# EAGLE design MLX90393_Magnetometer_Breakout (EAGLE 7.6.0)
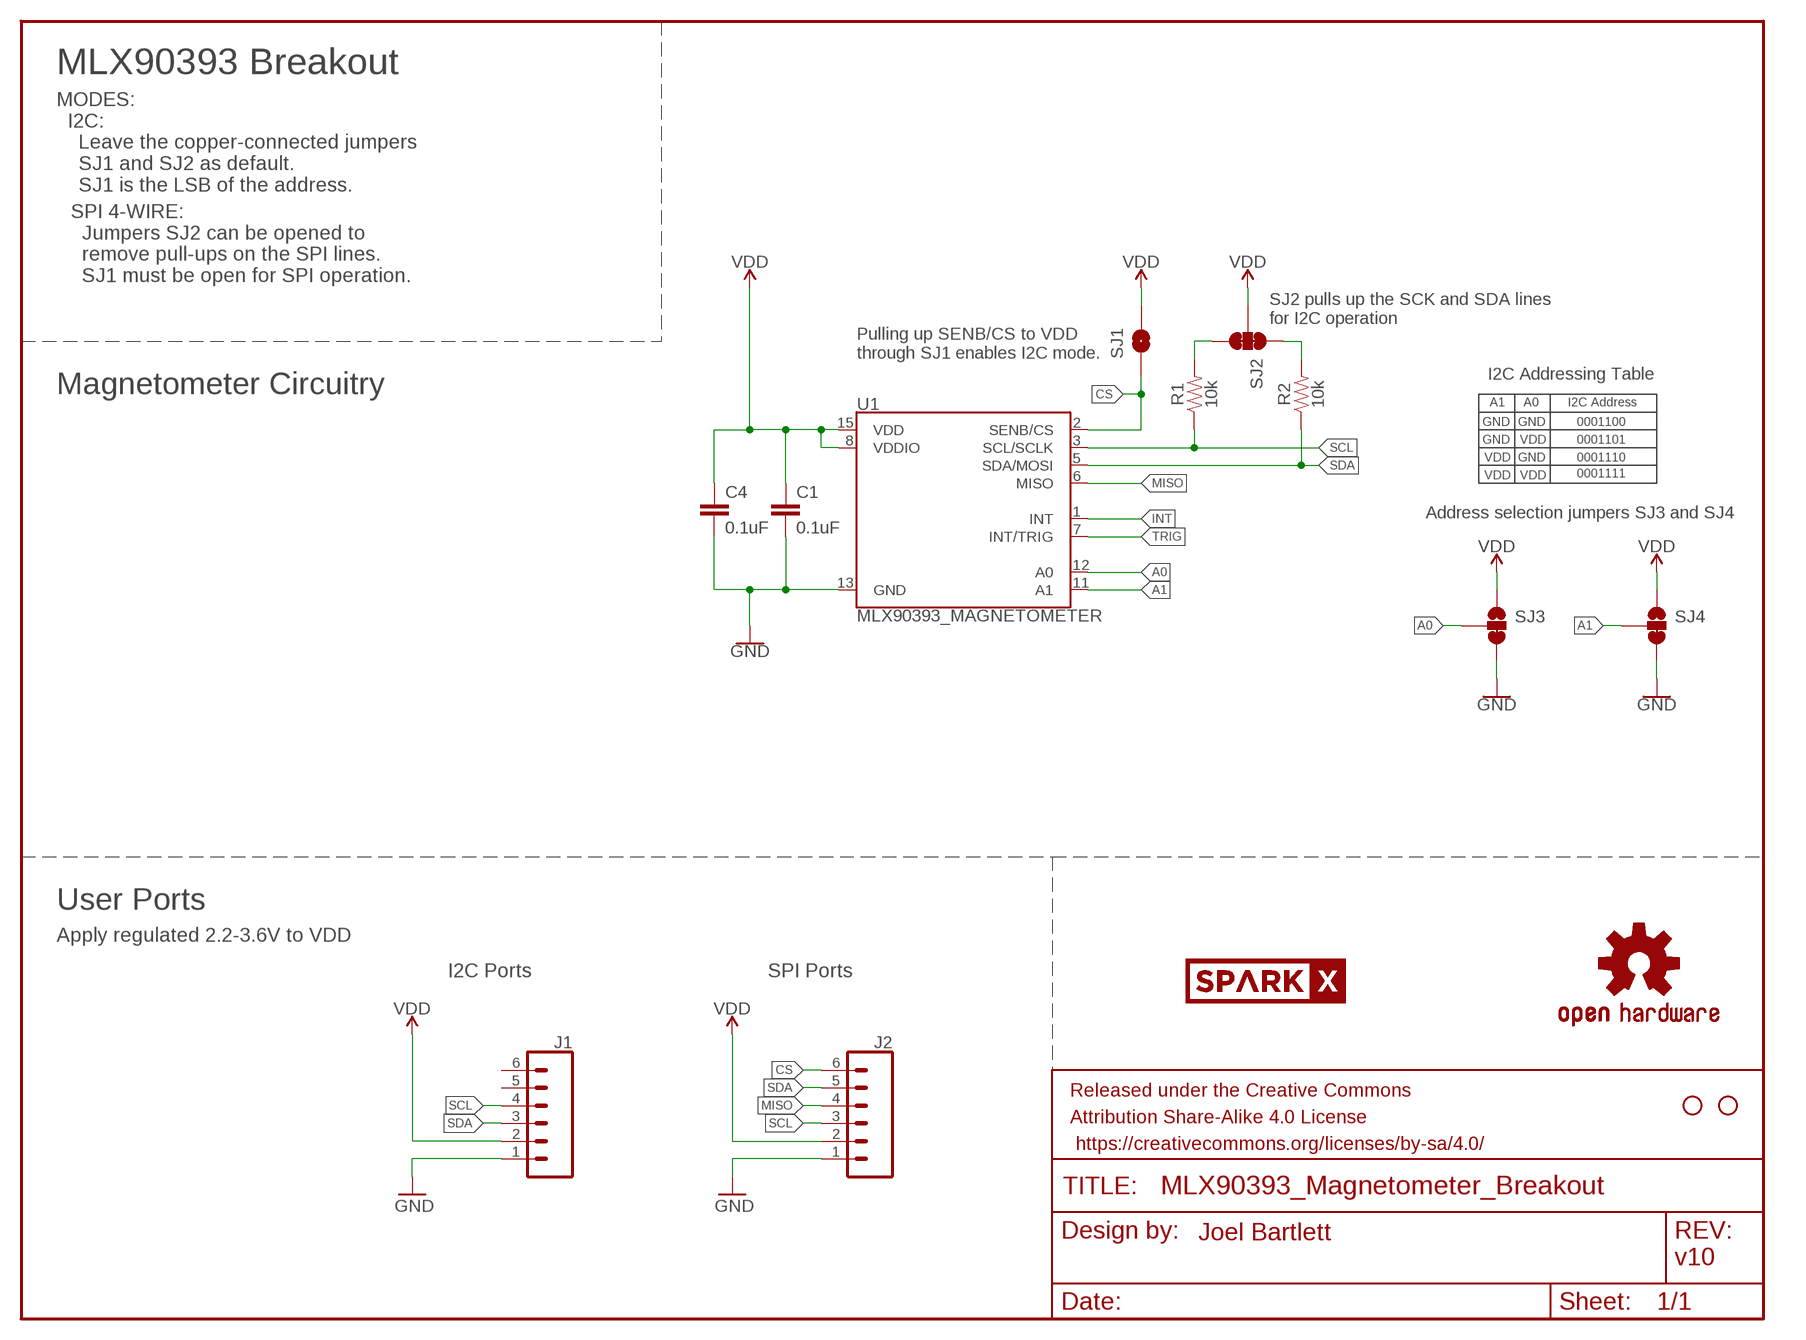
[diagram p0: schematic, sheet 1]

## Parts
C1  0.1uF  0.1UF-0603-25V-(+80/-20%)  [0603]
C4  0.1uF  0.1UF-0603-25V-(+80/-20%)  [0603]
FRAME2  FRAME-LETTER  [CREATIVE_COMMONS]
J1  CONN_06NO_SILK_FEMALE_PTH  [1X06_NO_SILK]
J2  CONN_06NO_SILK_FEMALE_PTH  [1X06_NO_SILK]
JP3  STAND-OFF  [STAND-OFF]
JP4  STAND-OFF  [STAND-OFF]
R1  10k  10KOHM-0603-1/10W-1%  [0603]
R2  10k  10KOHM-0603-1/10W-1%  [0603]
SJ1  SOLDERJUMPERTRACE  [SJ_2S-TRACE]
SJ2  JUMPER-PAD-3-NC_BY_TRACE  [PAD-JUMPER-3-3OF3_NC_BY_TRACE_YES_SILK_FULL_BOX]
SJ3  JUMPER-SMT_3_1-NC_TRACE_SILK  [SMT-JUMPER_3_1-NC_TRACE_SILK]
SJ4  JUMPER-SMT_3_1-NC_TRACE_SILK  [SMT-JUMPER_3_1-NC_TRACE_SILK]
U1  MLX90393_MAGNETOMETER  [QFN-16]
U$1  OSHW-LOGOS  [OSHW-LOGO-S]
U$2  SPARKX-LOGO2  [SPARKX-TINY]

## Nets
A0: SJ3.2 U1.12(A0)
A1: SJ4.2 U1.11(A1)
CS: J2.6 SJ1.1 U1.2(SENB/CS)
GND: C1.2 C4.2 J1.1 J2.1 SJ3.3 SJ4.3 U1.13(GND)
INT: U1.1(INT)
MISO: J2.4 U1.6(MISO)
N$4: R2.2 SJ2.1
N$5: R1.2 SJ2.3
SCL: J1.4 J2.3 R1.1 U1.3(SCL/SCLK)
SDA: J1.3 J2.5 R2.1 U1.5(SDA/MOSI)
TRIG: U1.7(INT/TRIG)
VDD: C1.1 C4.1 J1.2 J2.2 SJ1.2 SJ2.2 SJ3.1 SJ4.1 U1.8(VDDIO) U1.15(VDD)
Unconnected: J1.5 J1.6

## Notes on the sheet
- MLX90393 Breakout
- MODES:
    I2C:
      Leave the copper-connected jumpers
      SJ1 and SJ2 as default.
      SJ1 is the LSB of the address.
- SPI 4-WIRE:
    Jumpers SJ2 can be opened to 
    remove pull-ups on the SPI lines.
    SJ1 must be open for SPI operation.
- SJ2 pulls up the SCK and SDA lines
  for I2C operation
- Pulling up SENB/CS to VDD 
  through SJ1 enables I2C mode.
- I2C Addressing Table
- Magnetometer Circuitry
- A1 | A0 | I2C Address
- GND | GND | 0001100
- GND | VDD | 0001101
- VDD | GND | 0001110
- VDD | VDD | 0001111
- Address selection jumpers SJ3 and SJ4
- User Ports
- Apply regulated 2.2-3.6V to VDD
- I2C Ports | SPI Ports
- Joel Bartlett
- v10

## Library data of the parts
C1 C4 = SparkFun-Capacitors:0.1UF: 0.1µF ceramic capacitors A capacitor is a passive two-terminal electrical component used to store electrical energy temporarily in an electric field.; PROD_ID: CAP-00810
FRAME2 = SparkFun-Aesthetics:FRAME-LETTER: Schematic Frame Standard 8.5x11 US Letter frame
J1 J2 = SparkFun-Connectors:CONN_06: Header 6 Standard 6-pin 0.1" header. Use with straight break away headers (SKU : PRT-00116), right angle break away headers (PRT-00553), swiss pins (PRT-00743), machine pins (PRT-00117), and female headers (PRT-00115). Molex polarized connector foot print use with SKU : PRT-08094 with associated crimp pins and housings. NOTES ON THE VARIANTS LOCK and LOCK_LONGPADS... This footprint was designed to help hold the alignment of a through-hole component (i.e. 6-pin header) while soldering it into place. You may notice that each hole has been shifted either up or down by 0.005 of an inch from it's more standard position (which is a perfectly straight line). This slight alteration caused the pins (the squares in the middle) to touch the edges of the holes. Because they are alternating, it causes a "brace" to hold the component in place. 0.005 has proven to be the perfect amount of "off-center" position when using our standard breakaway headers. Although looks a little odd when you look at the bare footprint, once you have a header in there, the alteration is very hard to notice. Also,if you push a header all the way into place, it is covered up entirely on the bottom side. This idea of altering the position of holes to aid alignment will be further integrated into the Sparkfun Library for other footprints. It can help hold any component with 3 or more connection pins.; PROD_ID: CONN-08437
JP3 JP4 = SparkFun:STAND-OFF: Stand Off This is the mechanical footprint for a #4 phillips button head screw. Use the keepout ring to avoid running the screw head into surrounding components. SKU : PRT-00447
R1 R2 = SparkFun-Resistors:10KOHM: 10kΩ resistor A resistor is a passive two-terminal electrical component that implements electrical resistance as a circuit element. Resistors act to reduce current flow, and, at the same time, act to lower voltage levels within circuits.; PROD_ID: RES-00824
SJ1 = SparkFun:SOLDERJUMPER: Solder Jumper Standard SMD solder jumper. Used to automate production. Two varients : Normally Open and Normally Closed are the same, but have different paste layers. NC will have a large amount of paste and should jumper during reflow.
SJ2 = TestAperatures:JUMPER-PAD-3-NC_BY_TRACE
SJ3 SJ4 = SparkFun-Jumpers:JUMPER-SMT_3_1-NC_TRACE: Normally closed trace jumper (1 of 2 connections) This jumper has a trace between two pads so it's normally closed (NC). The other connection is normally open (NO). Use a razor knife to open the connection. For best results follow the IPC guidelines for cutting traces: Cutout at least 0.063 mm (0.005 in). Remove all loose material to clean up the cut area. Seal the cut with an approved epoxy. Reapply solder to reclose the connection, or to close the NO connection.
U1 = SparkX:MLX90393_MAGNETOMETER
U$1 = SparkFun:OSHW-LOGO: Open Source Hardware Logo This logo indicates the piece of hardware it is found on incorporates a OSHW license and/or adheres to the definition of open source hardware found here: http://freedomdefined.org/OSHW
U$2 = SparkX:SPARKX-LOGO

## Board
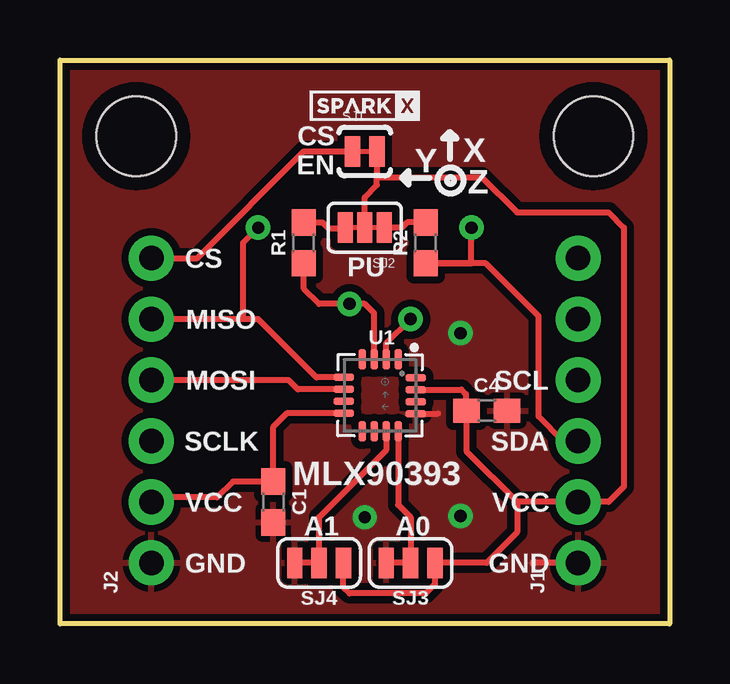
[diagram p1: board, top side]
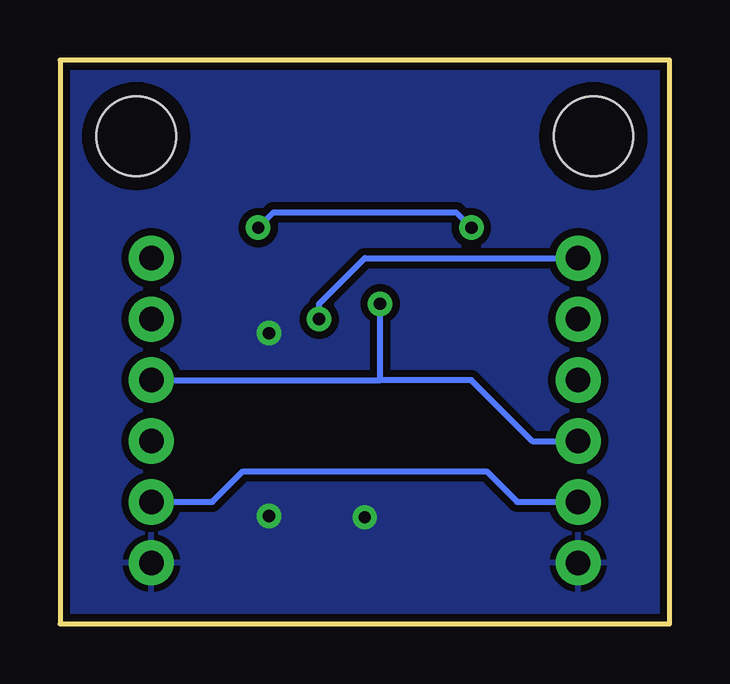
[diagram p2: board, bottom side, seen from below]

Size 25.4 x 23.5 mm. Coordinates in mm from the lower left corner, seen from the top.
Outline: 25.4,0 0,0 0,23.5 25.4,23.5 25.4,0
Copper layers (1*16): Top 0.035mm / dielectric 1.5mm / Bottom 0.035mm
Design rules "SparkFun-2-layer-STANDARD": minimum track width 10mil, minimum drill 20mil, track to track 10mil, track to pad 8mil, pad to pad 8mil, via to via 10mil, smd to smd 8mil, copper to edge 8mil, drill to drill 8mil, minimum pad ring 10mil, minimum via ring 10mil, stop-mask expansion 4mil, vias tented up to drill 25mil, thermal gap 10mil

### Footprints (pad centres in the part's own frame; a part is rotated, then mirrored left to right if it is on the bottom)
0603 = smd 1.1 x 1: 1 -0.85,0; 2 0.85,0
1X06_NO_SILK = drill 1.016 pad 1.88: 1 0,0; 2 2.54,0; 3 5.08,0; 4 7.62,0; 5 10.16,0; 6 12.7,0
STAND-OFF = hole 3.302: 0,0
SJ_2S-TRACE = smd 0.635 x 1.27: 1 -0.508,0; 2 0.508,0
PAD-JUMPER-3-3OF3_NC_BY_TRACE_YES_SILK_FULL_BOX = smd 0.635 x 1.27: 1 -0.813,0; 2 0,0; 3 0.813,0
SMT-JUMPER_3_1-NC_TRACE_SILK = smd 0.635 x 1.27: 1 -1.016,0; 2 0,0; 3 1.016,0
QFN-16 = smd 0.3 x 0.85: 1 0.754,1.498; 2 0.254,1.498; 3 -0.246,1.498; 4 -0.746,1.498; 9 -0.746,-1.506; 10 -0.246,-1.506; 11 0.254,-1.506; 12 0.754,-1.506 | smd 0.85 x 0.3: 5 -1.508,0.746; 6 -1.508,0.246; 7 -1.508,-0.254; 8 -1.508,-0.754; 13 1.496,-0.764; 14 1.496,-0.264; 15 1.496,0.236; 16 1.496,0.736

### Placement (x,y rotation side)
C1  8.89,5.08 270 top
C4  17.78,8.89 0 top
FRAME2  -18.41,-8.89 0 top  (outside the outline)
J1  21.59,2.54 90 top
J2  3.81,2.54 90 top
JP3  3.17,20.32 0 top
JP4  22.22,20.32 0 top
R1  10.16,15.88 90 top
R2  15.24,15.88 90 top
SJ1  12.7,19.68 0 top
SJ2  12.7,16.51 180 top
SJ3  14.61,2.54 180 top
SJ4  10.8,2.54 180 top
U1  13.34,9.53 0 top
U$1  -10.8,0.64 0 bottom  (outside the outline)
U$2  12.7,21.59 0 top

### Tracks (layer width: path | path; a pad name or v marks a point on that pad's centre or on a via)
A0
  Top 0.254: U1.12 14.09,4.96 14.61,4.45 SJ3.2
A1
  Top 0.254: SJ4.2 10.8,4.45 13.59,7.24 U1.11
CS  (via drill 0.51)
  Top 0.254: J2.6 5.71,15.24 10.16,19.68 SJ1.1 | U1.2 13.59,11.68 v14.61,12.7
  Bottom 0.254: v14.61,12.7 14.61,13.33 12.7,15.24 J2.6
GND  (via drill 0.51)
  Top 0.254: J1.1 19.68,2.54 | 14.86,8.76 15.75,8.76
  other vias: 16.69,4.5 12.7,4.45 16.69,12.12
  pour Top (isolate 0.305): 0,23.5 0,0 25.4,0 25.4,23.5
  pour Bottom (isolate 0.305): 0,23.5 0,0 25.4,0 25.4,23.5
MISO
  Top 0.254: U1.6 9.91,9.77 9.53,10.16 J2.4
N$4
  Top 0.254: R2.2 14.46,16.73 14.25,16.51 SJ2.1
N$5
  Top 0.254: R1.2 10.94,16.73 11.18,16.48 11.86,16.48 SJ2.3
SCL  (via drill 0.51)
  Top 0.254: U1.3 13.09,12.95 12.7,13.33 v12.07,13.33 10.8,13.33 10.16,13.97 R1.1
  Bottom 0.254: J1.4 12.07,10.16 | J2.3 5.71,7.62 8.25,10.16 12.07,10.16 | 12.07,10.16 v12.07,13.33
SDA  (via drill 0.51)
  Top 0.254: U1.5 10.68,10.27 8.25,12.7 7.62,12.7 | 7.62,12.7 J2.5 | J1.3 20.95,7.62 19.94,8.64 19.94,12.83 17.74,15.03 R2.1 17.14,15.03 v17.14,16.51 | v8.25,16.51 7.62,15.88 7.62,12.7
  Bottom 0.254: v17.14,16.51 16.51,17.14 8.89,17.14 v8.25,16.51
VDD
  Top 0.254: SJ1.2 13.21,18.62 | SJ2.2 12.7,17.78 13.21,18.29 13.21,18.62 | 13.21,18.62 17.58,18.62 19.05,17.14 22.86,17.14 23.49,16.51 23.49,5.71 22.86,5.08 J1.2 19.05,5.08 | SJ4.1 11.81,1.52 12.07,1.27 15.24,1.27 15.62,1.65 SJ3.1 17.78,2.54 19.05,3.81 19.05,5.08 | U1.15 16.73,9.76 16.92,9.58 16.92,8.9 C4.1 16.93,7.2 19.05,5.08 | J2.2 4,5.27 6.54,5.27 7.2,5.93 C1.1 8.89,8.22 9.44,8.77 U1.8
  Bottom 0.254: J2.2 6.35,5.08 7.62,6.35 17.78,6.35 19.05,5.08 J1.2

### Text on the board
tPlace: Y | X | CS / EN | Z | CS | PU | MISO | MOSI | SCL | SCLK | SDA | MLX90393 | VCC | VCC | A1 | A0 | GND | GND